# Altium schematic sheet TPS61169_SEPIC_60_mA_LED_Driver_V2.0.SchDoc: TPS61169 SEPIC 100 mA LED Driver
size A4
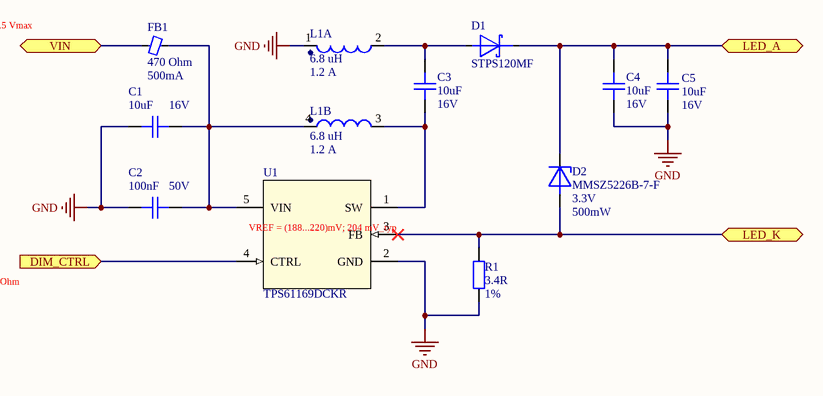
[diagram p0: TPS61169_SEPIC_60_mA_LED_Driver_V2.0.SchDoc]

## Parts
C1  Voltage Rating: 16V  Capacitance: 10uF  [C0603]  (hidden comment: CAP CER 10UF 16V X5R 0603)
C2  Capacitance: 100nF  Voltage: 50V  [C0402]  (hidden comment: CAP CER 0.1UF 50V X7R 0402)
C3  Capacitance: 10uF  Voltage Rating: 16V  [C0805]  (hidden comment: CAP CER 10UF 16V X7R 0805)
C4  Capacitance: 10uF  Voltage Rating: 16V  [C0603]  (hidden comment: CAP CER 10UF 16V X5R 0603)
C5  Voltage Rating: 16V  Capacitance: 10uF  [C0603]  (hidden comment: CAP CER 10UF 16V X5R 0603)
D1  STPS120MF  [SODFL375X95-2N]
D2  MMSZ5226B-7-F  Working Voltage: 3.3V  Power Rating: 500mW  [SOD-123]
FB1  Impedance: 470 Ohm  Current Rating: 500mA  [L0603]  (hidden comment: FERRITE BEAD 470 OHM 0603 1LN)
L1  Inductance: 6.8 uH  Maximum DC Current: 1.2 A  [IND_LPD5030]  (hidden comment: FIXED IND COUIPLED 6.8UH 1.2A 160 mOHM SMD)  (parts A,B of 2)
R1  Resistance: 3.4R  Tolerance: 1%  [R0603]  (hidden comment: RES SMD 3.4 OHM 1% 1/10W 0603)
U1  TPS61169DCKR  [DCK0005A_L]

## Ports
DIM_CTRL (in), LED_A, LED_K, VIN

## Nets
GND: C1.1 C2.2 C4.1 C5.2 L1.1 R1.1 U1.2(GND)
DIM_CTRL: U1.4(CTRL) ; port DIM_CTRL
LED_A: C4.2 C5.1 D1.1(K) D2.1(K) ; port LED_A
LED_K: D2.2(A) R1.2 U1.3(FB) ; port LED_K
VIN: FB1.1 ; port VIN
NetC1_2: C1.2 C2.1 FB1.2 L1.4 U1.5(VIN)
NetC3_1: C3.1 L1.3 U1.1(SW)
NetC3_2: C3.2 D1.2(A) L1.2

## Notes on the sheet
- (near FB1) VIN = 5.5 Vmax
- VREF = (188...220)mV; 204 mV_typ
- (near U1) CTRL pin internal pull-down  resistor 300 kOhm
- Title
- Size:
- Date:
- A4
- Number:
- Time:
- Revision:
- Sheet
- of
- File:

## Library data of the parts
C1 C4 C5 = CAP CER 10UF 16V X5R 0603: 10µF ±10% 16V Ceramic Capacitor X5R 0603 (1608 Metric); Manufacturer: Murata; Manufacturer Part Number: GRM188R61C106KAALJ; Supplier 1: Digi-Key; Stock 1: 5470; Pricing 1: 1=0.39, 10=0.271, 100=0.1628, 500=0.1221, 1000=0.1031, 2500=0.0977, 5000=0.0923 (USD); Mount: Surface Mount; Case Code (Imperial): 0603; Case Code (Metric): 1608; Min Operating Temperature: -55°C; Max Operating Temperature: 85°C; Voltage Rating (DC): 16V; Tolerance: 10%; Packaging: Tape and Reel; Dielectric: X5R; Termination: SMD/SMT; Length: 0.063inch; Height: 0.8mm; Width: 0.031inch; Thickness: 0.037inch; Supplier Part Number 1: 490-12736-1-ND; Case/Package: 0603; Weight: 0.000222oz; Composition: Ceramic; Package Quantity: 10000
C2 = CAP CER 0.1UF 50V X7R 0402: 0.1µF ±10% 50V Ceramic Capacitor X7R 0402 (1005 Metric); Manufacturer: TDK; Manufacturer Part Number: CGA2B3X7R1H104K050BB; Supplier 1: Digi-Key; Stock 1: 2925303; Pricing 1: 1=0.17, 10=0.118, 50=0.0668, 100=0.0553, 500=0.0388, 1000=0.0321, 2500=0.0299, 5000=0.0273 (USD); Mount: Surface Mount; Case Code (Imperial): 0402; Case Code (Metric): 1005; Min Operating Temperature: -55°C; Max Operating Temperature: 125°C; Tolerance: 10%; Packaging: Tape and Reel; Termination: SMD/SMT; Voltage Rating (DC): 50V; Composition: Ceramic; Length: 1mm; Height: 0.5mm; Width: 0.02inch; Thickness: 0.022inch; Depth: 0.5mm; Lead Free: Lead Free; ComponentLink1URL: http://product.tdk.com/capacitor/mlcc/en/documents/mlccspec_automotive_general_midvoltage_en.pdf?src-supplier=Future+Electronics; ComponentLink1Description: http://product.tdk.com/capacitor/mlcc/en/documents/mlccspec_automotive_general_midvoltage_en.pdf?src-supplier=Future+Electronics; Supplier Part Number 1: 445-6899-1-ND; Dielectric: X7R; Voltage Rating: 50V; Package Quantity: 1; REACH SVHC: No SVHC; ComponentLink2URL: http://www.farnell.com/datasheets/1807242.pdf?src-supplier=Element14; ComponentLink2Description: http://www.farnell.com/datasheets/1807242.pdf?src-supplier=Element14; ComponentLink3URL: http://www.mouser.com/ds/2/400/lcc_automotive_general_en-843974.pdf?src-supplier=Mouser; ComponentLink3Description: http://www.mouser.com/ds/2/400/lcc_automotive_general_en-843974.pdf?src-supplier=Mouser; ComponentLink4URL: http://www.farnell.com/datasheets/1936565.pdf?src-supplier=Element14; ComponentLink4Description: http://www.farnell.com/datasheets/1936565.pdf?src-supplier=Element14; ComponentLink5URL: http://www.farnell.com/datasheets/1735392.pdf?src-supplier=Element14; ComponentLink5Description: http://www.farnell.com/datasheets/1735392.pdf?src-supplier=Element14; Case/Package: 0402; Weight: 2.3E-05oz; Ratings: AEC-Q200
C3 = CAP CER 10UF 16V X7R 0805: 10µF ±10% 16V Ceramic Capacitor X7R 0805 (2012 Metric); Manufacturer: Samsung; Manufacturer Part Number: CL21B106KOQNNNG; Supplier 1: Digi-Key; Stock 1: 251380; Pricing 1: 1=0.3, 10=0.207, 100=0.1173, 500=0.0828, 1000=0.0725 (USD); Mount: Surface Mount; Case/Package: 0805; Case Code (Metric): 2012; Case Code (Imperial): 0805; Material: Ceramic; Min Operating Temperature: -55°C; Max Operating Temperature: 125°C; Tolerance: 10%; Packaging: Tape and Reel; Package Quantity: 3000; Length: 0.079inch; Width: 0.049inch; Thickness: 0.055inch; Depth: 1.25mm; Lead Free: Lead Free; ComponentLink1URL: http://www.samsungsem.com/kr/support/product-search/mlcc/CL21B106KOQNNNG.jsp?src-supplier=Digi-Key; ComponentLink1Description: http://www.samsungsem.com/kr/support/product-search/mlcc/CL21B106KOQNNNG.jsp?src-supplier=Digi-Key; ComponentLink2URL: https://produktinfo.conrad.com/datenblaetter/450000-474999/454918-da-01-en-VS_KONDENSATOR_0805.pdf?src-supplier=Conrad; ComponentLink2Description: https://produktinfo.conrad.com/datenblaetter/450000-474999/454918-da-01-en-VS_KONDENSATOR_0805.pdf?src-supplier=Conrad; Supplier Part Number 1: 1276-6472-1-ND; Dielectric: X7R
D1 = DIODE SCHOTTKY 20V 1A STMITEFLAT: Diode Schottky 20V 1A Surface Mount STmite Flat; Manufacturer: STMicroelectronics; Forward Voltage: 440mV; Max Surge Current: 50A; Peak Reverse Current: 3.9uA; Element Configuration: Single; Max Reverse Leakage Current: 300uA; Supplier 1: Digi-Key; Manufacturer Part Number: STPS120MF; Stock 1: 3984; Pricing 1: 1=0.48, 10=0.409, 100=0.3057, 500=0.2402, 1000=0.1856, 2500=0.1692, 5000=0.1583 (USD); ComponentLink1URL: http://www.st.com/web/en/resource/technical/document/datasheet/CD00198749.pdf?src-supplier=Future+Electronics; ComponentLink1Description: http://www.st.com/web/en/resource/technical/document/datasheet/CD00198749.pdf?src-supplier=Future+Electronics; Supplier Part Number 1: 497-12281-1-ND; Packaging: Tape and Reel; Mount: Surface Mount; Number of Pins: 2; Min Operating Temperature: -65°C; Max Operating Temperature: 150°C; Forward Current: 1A; Package Quantity: 1; Average Rectified Current: 1A; Max Repetitive Reverse Voltage (Vrrm): 20V; Peak Non-Repetitive Surge Current: 50A; Max Reverse Voltage (DC): 20V; Radiation Hardening: No; Lead Free: Lead Free; ComponentLink2URL: http://www.st.com/content/ccc/resource/technical/document/datasheet/b2/7e/6d/c8/81/31/4e/f2/CD00198749.pdf/files/CD00198749.pdf/jcr:content/translations/en.CD00198749.pdf?src-supplier=Digi-Key; ComponentLink2Description: http://www.st.com/content/ccc/resource/technical/document/datasheet/b2/7e/6d/c8/81/31/4e/f2/CD00198749.pdf/files/CD00198749.pdf/jcr:content/translations/en.CD00198749.pdf?src-supplier=Digi-Key; ComponentLink3URL: http://www.st.com/st-web-ui/static/active/en/resource/technical/document/datasheet/CD00198749.pdf?src-supplier=Mouser; ComponentLink3Description: http://www.st.com/st-web-ui/static/active/en/resource/technical/document/datasheet/CD00198749.pdf?src-supplier=Mouser
D2 = DIODE ZENER 3.3V 500MW SOD123: Zener Diode ±5% Surface Mount SOD-123; Manufacturer: Diodes; Forward Voltage: 900mV; Impedance: 28R; Max Reverse Leakage Current: 25uA; Test Current: 20mA; Element Configuration: Single; Supplier 1: Digi-Key; Manufacturer Part Number: MMSZ5226B-7-F; Stock 1: 63613; Pricing 1: 1=0.19, 10=0.164, 100=0.063, 500=0.046, 1000=0.0309 (USD); Mount: Surface Mount; Number of Pins: 2; Weight: 0.000353oz; Min Operating Temperature: -65°C; Max Operating Temperature: 150°C; Packaging: Tape and Reel; Package Quantity: 3000; Tolerance: 5%; Max Power Dissipation: 500mW; Zener Voltage: 3.3V; Voltage Tolerance: 5%; Power Dissipation: 500mW; Length: 3.85mm; Height: 1.35mm; Width: 1.7mm; Radiation Hardening: No; Lead Free: Lead Free; ComponentLink1URL: http://www.diodes.com/datasheets/ds18010.pdf?src-supplier=Avnet+Europe; ComponentLink1Description: http://www.diodes.com/datasheets/ds18010.pdf?src-supplier=Avnet+Europe; Supplier Part Number 1: MMSZ5226B-FDICT-ND; Case/Package: SOD-123-2; Zener Current: 25uA; Max Reverse Current: 25uA; Termination: SMD/SMT; Voltage Rating (DC): 3.3V
FB1 = FERRITE BEAD 470 OHM 0603 1LN: 470 Ohms @ 100MHz 1  Ferrite Bead 0603 (1608 Metric) 500mA 210mOhm; Manufacturer: Murata; Manufacturer Part Number: BLM18EG471SN1D; Material: Ferrite,Steel; Tolerance: 25%; DC Resistance (DCR): 210mR; Number of Lines: 1; Supplier 1: Digi-Key; Stock 1: 4285; Pricing 1: 1=0.23, 10=0.175, 25=0.1452, 50=0.1252, 100=0.1126, 250=0.0951, 500=0.0851, 1000=0.0726 (USD); Case/Package: 0603; Number of Pins: 2; Weight: 7.1E-05oz; Core Material: Ferrite; Case Code (Metric): 1608; Case Code (Imperial): 0603; Min Operating Temperature: -55°C; Max Operating Temperature: 125°C; Max DC Current: 500mA; Resistance: 210mR; Package Quantity: 1; Packaging: Tape and Reel; Max Current Rating: 500mA; Termination: SMD/SMT; Test Frequency: 100MHz; DC Current: 500mA; Military Standard: Not; Frequency: 100MHz; Number of Circuits: 1; Length: 1.6mm; Height: 0.8mm; Width: 0.8mm; Depth: 0.8mm; Radiation Hardening: No; REACH SVHC: No SVHC; Lead Free: Lead Free; ComponentLink1URL: http://uk.rs-online.com/webdocs/11b5/0900766b811b5866.pdf?src-supplier=RSComponents; ComponentLink1Description: http://uk.rs-online.com/webdocs/11b5/0900766b811b5866.pdf?src-supplier=RSComponents; ComponentLink2URL: http://www.farnell.com/datasheets/5169.pdf?src-supplier=Element14; ComponentLink2Description: http://www.farnell.com/datasheets/5169.pdf?src-supplier=Element14; ComponentLink3URL: https://www.murata.com/en-global/products/productdata/8796733767710/S0580E.pdf?src-supplier=Digi-Key; ComponentLink3Description: https://www.murata.com/en-global/products/productdata/8796733767710/S0580E.pdf?src-supplier=Digi-Key; ComponentLink4URL: https://www.distrelec.biz/Web/Downloads/_t/ds/blm-series_eng_tds.pdf?mime=application%2Fpdf&src-supplier=Distrelec; ComponentLink4Description: https://www.distrelec.biz/Web/Downloads/_t/ds/blm-series_eng_tds.pdf?mime=application%2Fpdf&src-supplier=Distrelec; ComponentLink5URL: https://www.verical.com/server-webapp/html/getDatasheet?partID=228865&src-supplier=Verical; ComponentLink5Description: https://www.verical.com/server-webapp/html/getDatasheet?partID=228865&src-supplier=Verical; ComponentLink6URL: http://search.murata.co.jp/Ceramy/image/img/PDF/ENG/L0110S0101BLM18E.pdf?src-supplier=Avnet; ComponentLink6Description: http://search.murata.co.jp/Ceramy/image/img/PDF/ENG/L0110S0101BLM18E.pdf?src-supplier=Avnet; ComponentLink7URL: http://www.produktinfo.conrad.com/datenblaetter/1100000-1199999/001171700-da-01-en-CHIP_DROSSEL0603_470R_500MA_1_6X0_8MM.pdf?src-supplier=Conrad; ComponentLink7Description: http://www.produktinfo.conrad.com/datenblaetter/1100000-1199999/001171700-da-01-en-CHIP_DROSSEL0603_470R_500MA_1_6X0_8MM.pdf?src-supplier=Conrad; ComponentLink8URL: http://www.produktinfo.conrad.com/datenblaetter/1100000-1199999/001172269-da-01-en-DROSSEL_0603_470R_1_6X0_8MM_4000ST.pdf?src-supplier=Conrad; ComponentLink8Description: http://www.produktinfo.conrad.com/datenblaetter/1100000-1199999/001172269-da-01-en-DROSSEL_0603_470R_1_6X0_8MM_4000ST.pdf?src-supplier=Conrad; Supplier Part Number 1: 490-3993-6-ND; Mount: Surface Mount
L1 = FIXED IND COUIPLED 6.8UH 1.2A 160 mOHM SMD: 6.8µH Shielded Coupled Inductors 1.2A 160mOhm Max 1919 (4.8x4.8 Metric); Manufacturer: Coilcraft; Manufacturer Part Number: LPD5030-682MR; Tolerance: 30 %; Self Resonant Frequency: 40 MHz; Test Frequency: 100 kHz; Type: SMD Inductor; Packaging: Cut Tape; Shielding: Shielded; Termination: -; Length: 4.8 mm; Height: 2.9 mm; Width: 4.8 mm; ComponentLink1URL: https://www.coilcraft.com/getmedia/492eebb2-11bb-49ba-b07b-44c830c73f93/msd1048h.pdf; ComponentLink1Description: https://www.coilcraft.com/en-us/products/power/coupled-inductors/1-1-shielded-coupled/msd_h/msd1048h/#; Category: Fixed Coupled Inductors; Application: Power; Maximum DC Resistance: 160 mOhms; Product: Power Inductors; Series: LPD5030; Termination Style: SMD/SMT; Brand: Coilcraft; Mounting Style: PCB Mount; Maximum Operating Temperature: + 125 C; Minimum Operating Temperature: - 40 C; Product Type: Fixed Coupled Inductors; Subcategory: Inductors, Chokes & Coils; Minimum Order Quantity: 1; Reeling: True; Mount: Surface Mount
R1 = RES SMD 3.4 OHM 1% 1/10W 0603: 3.4 Ohms ±1% 0.1W, 1/10W Chip Resistor 0603 (1608 Metric) Automotive AEC-Q200 Thick Film; Manufacturer Part Number: CRCW06033R40FKEA; Manufacturer: Vishay Dale; Temperature Coefficient: 100ppm/°C; Voltage Rating: 75V; Power Rating: 100mW; Supplier 1: Digi-Key; Stock 1: 18141; Pricing 1: 1=0.1, 10=0.04, 100=0.0164, 1000=0.0074, 2500=0.0064 (USD); Case Code (Imperial): 0603; Case Code (Metric): 1608; Min Operating Temperature: -55°C; Max Operating Temperature: 155°C; Composition: Thick Film; Packaging: Tape and Reel; Termination: SMD/SMT; Military Standard: Not; Number of Terminations: 2; Length: 1.55mm; Height: 0.02inch; Width: 0.85mm; Depth: 0.85mm; Lead Free: Lead Free; ComponentLink1URL: http://www.vishay.com/docs/20035/dcrcwe3.pdf?src-supplier=Avnet; ComponentLink1Description: http://www.vishay.com/docs/20035/dcrcwe3.pdf?src-supplier=Avnet; Supplier Part Number 1: 541-3.40HHTR-ND; Case/Package: 0603; Weight: 7.1E-05oz; Contact Plating: Tin; Package Quantity: 5000; Max Power Dissipation: 100mW; Features: Automotive AEC-Q200; Radiation Hardening: No; Mount: Surface Mount
U1 = IC TPS61169 WLED BACKLIGHT DRIVER SC70-5: LED Driver IC 1 Output DC DC Regulator Step-Up (Boost) PWM Dimming 1.8A (Switch) SC-70-5; Manufacturer: Texas Instruments; Number of Outputs: 1; Output Current: 400mA; Output Voltage: 38V; Max Output Current: 2.4A; Switching Frequency: 1.2MHz; Max Input Voltage: 5.5V; Min Input Voltage: 2.7V; Output Type: Frequency; Nominal Input Voltage (DC): 3.6V; Supplier 1: Digi-Key; Manufacturer Part Number: TPS61169DCKR; Stock 1: 112915; Pricing 1: 1=0.9, 10=0.805, 25=0.7644, 100=0.587, 250=0.5187, 500=0.4914, 1000=0.3822 (USD); Case/Package: SC; Number of Pins: 5; Min Operating Temperature: -40°C; Max Operating Temperature: 85°C; Packaging: Tape and Reel; Package Quantity: 3000; Min Output Voltage: 2.7V; Max Output Voltage: 38V; Topology: Boost; Lead Free: Lead Free; REACH SVHC: No SVHC; ComponentLink1URL: http://www.ti.com/general/docs/lit/getliterature.tsp?genericPartNumber=TPS61169&&fileType=pdf&src-supplier=Element14; ComponentLink1Description: http://www.ti.com/general/docs/lit/getliterature.tsp?genericPartNumber=TPS61169&&fileType=pdf&src-supplier=Element14; ComponentLink2URL: http://www.ti.com/general/docs/lit/getliterature.tsp?genericPartNumber=TPS61169&amp;&amp;fileType=pdf&src-supplier=Farnell; ComponentLink2Description: http://www.ti.com/general/docs/lit/getliterature.tsp?genericPartNumber=TPS61169&amp;&amp;fileType=pdf&src-supplier=Farnell; ComponentLink3URL: http://www.ti.com/lit/ds/symlink/tps61169.pdf?src-supplier=Digi-Key; ComponentLink3Description: http://www.ti.com/lit/ds/symlink/tps61169.pdf?src-supplier=Digi-Key; ComponentLink4URL: http://www.ti.com/general/docs/lit/getliterature.tsp?genericPartNumber=TPS61169&&fileType=pdf&src-supplier=Avnet; ComponentLink4Description: http://www.ti.com/general/docs/lit/getliterature.tsp?genericPartNumber=TPS61169&&fileType=pdf&src-supplier=Avnet; Supplier Part Number 1: 296-40821-1-ND; Mount: Surface Mount; Weight: 0.000705oz; Contact Plating: Gold; Number of Channels: 1; Max Supply Voltage: 5.5V; Output Current per Channel: 1.8A; Frequency: 1.2MHz; Max Input Voltage (DC): 5.5V; Dimming: PWM; Length: 2mm; Height: 1.1mm; Width: 1.25mm; ComponentLink5URL: http://www.ti.com/lit/gpn/tps61169?src-supplier=Mouser; ComponentLink5Description: http://www.ti.com/lit/gpn/tps61169?src-supplier=Mouser